# EAGLE schematic LedCube (EAGLE 8.1.1)
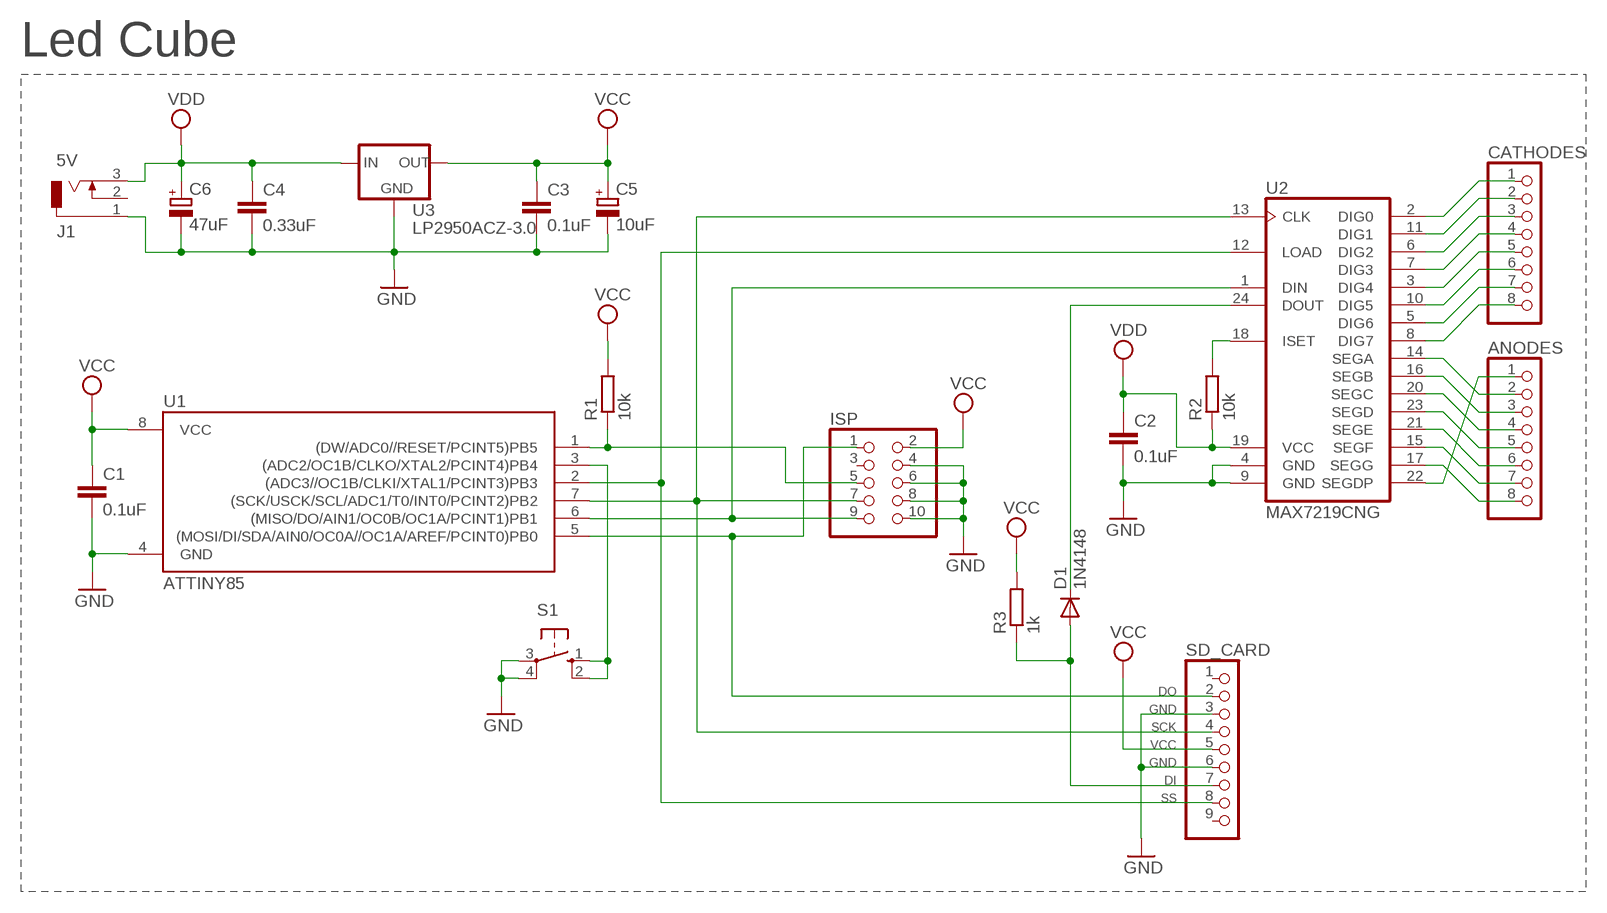
[diagram p0: schematic, sheet 1]

## Parts
ANODES  PINHD-1X8/90  [1X08/90]
C1  0.1uF  C-EU050-025X075  [C050-025X075]
C2  0.1uF  C-EU050-025X075  [C050-025X075]
C3  0.1uF  C-EU050-025X075  [C050-025X075]
C4  0.33uF  C-EU050-045X075  [C050-045X075]
C5  10uF  CPOL-EUE2.5-5  [E2,5-5]
C6  47uF  CPOL-EUE2.5-6  [E2,5-6]
CATHODES  PINHD-1X8/90  [1X08/90]
D1  1N4148  DIODE-D-5  [D-5]
ISP  PINHD-2X5  [2X05]
J1  5V  DCJ0202  [DCJ0202]
R1  10k  R-EU_0207/7  [0207/7]
R2  10k  R-EU_0207/7  [0207/7]
R3  1k  R-EU_0207/7  [0207/7]
S1  10-XX  [B3F-10XX]
SD_CARD  PINHD-1X9/90  [1X09/90]
U1  ATTINY85  [DIL08]
U2  MAX7219CNG  [DIL24-3]
U3  LP2950ACZ-3.0  [TO92]

## Nets
GND: C1.2 C2.2 C3.2 C4.2 C5.- C6.- ISP.4 ISP.6 ISP.8 ISP.10 J1.1 S1.3(P) S1.4(P1) U1.4(GND) U2.4(GND) U2.9(GND) U3.2(GND)
N$1: ISP.1 SD_CARD.2 U1.5((MOSI/DI/SDA/AIN0/OC0A//OC1A/AREF/PCINT0)PB0)
N$2: SD_CARD.3 SD_CARD.6 ; supply symbol labelled GND
N$3: ISP.7 SD_CARD.4 U1.7((SCK/USCK/SCL/ADC1/T0/INT0/PCINT2)PB2) U2.13(CLK)
N$4: ISP.9 U1.6((MISO/DO/AIN1/OC0B/OC1A/PCINT1)PB1) U2.1(DIN)
N$5: SD_CARD.8 U1.2((ADC3//OC1B/CLKI/XTAL1/PCINT3)PB3) U2.12(LOAD)
N$6: ISP.5 R1.1 U1.1((DW/ADC0//RESET/PCINT5)PB5)
N$7: D1.C U2.24(DOUT)
N$8: D1.A R3.1 SD_CARD.7
N$9: S1.1(S) S1.2(S1) U1.3((ADC2/OC1B/CLKO/XTAL2/PCINT4)PB4)
N$10: R2.2 U2.18(ISET)
N$11: CATHODES.1 U2.2(DIG0)
N$12: CATHODES.2 U2.11(DIG1)
N$13: CATHODES.3 U2.6(DIG2)
N$14: CATHODES.4 U2.7(DIG3)
N$15: CATHODES.5 U2.3(DIG4)
N$16: CATHODES.6 U2.10(DIG5)
N$17: CATHODES.7 U2.5(DIG6)
N$18: CATHODES.8 U2.8(DIG7)
N$19: ANODES.2 U2.14(SEGA)
N$20: ANODES.3 U2.16(SEGB)
N$21: ANODES.4 U2.20(SEGC)
N$22: ANODES.5 U2.23(SEGD)
N$23: ANODES.6 U2.21(SEGE)
N$24: ANODES.7 U2.15(SEGF)
N$25: ANODES.8 U2.17(SEGG)
N$26: ANODES.1 U2.22(SEGDP)
VCC: C1.1 C3.1 C5.+ ISP.2 R1.2 R3.2 SD_CARD.5 U1.8(VCC) U3.1(OUT)
VDD: C2.1 C4.1 C6.+ J1.3 R2.1 U2.19(VCC) U3.3(IN)
Unconnected: ISP.3 J1.2 SD_CARD.1 SD_CARD.9

## Notes on the sheet
- Led Cube
- DO
- GND
- SCK
- VCC
- GND
- DI
- SS

## Library data of the parts
ANODES CATHODES = pinhead:PINHD-1X8: PIN HEADER
C1-C4 = resistor:C-EU: CAPACITOR, European symbol
C5 C6 = resistor:CPOL-EU: POLARIZED CAPACITOR, European symbol
D1 = diode:DIODE-: DIODE
ISP = pinhead:PINHD-2X5: PIN HEADER
J1 = con-jack:DCJ0202: DC POWER JACK Source: DCJ0202.pdf; OC_FARNELL: unknown; OC_NEWARK: unknown
R1-R3 = resistor:R-EU_: RESISTOR, European symbol
S1 = switch-omron:10-XX: OMRON SWITCH; MPN: B3F-1000; OC_FARNELL: 176432; OC_NEWARK: 36M3542
SD_CARD = pinhead:PINHD-1X9: PIN HEADER
U1 = .MW:ATTINY85: MICROCONTROLLER 8 Kbytes FLASH 512 bytes SRAM 512 bytes EEPROM
U2 = maxim:MAX7219CNG: LED DISPLAY DRIVER; MF: MAXIM; MPN: MAX7219CNG; OC_FARNELL: 1523914; OC_NEWARK: 34C4018
U3 = v-reg:LP2950?*: Source: http://cache.national.com/ds/LP/LP2950.pdf